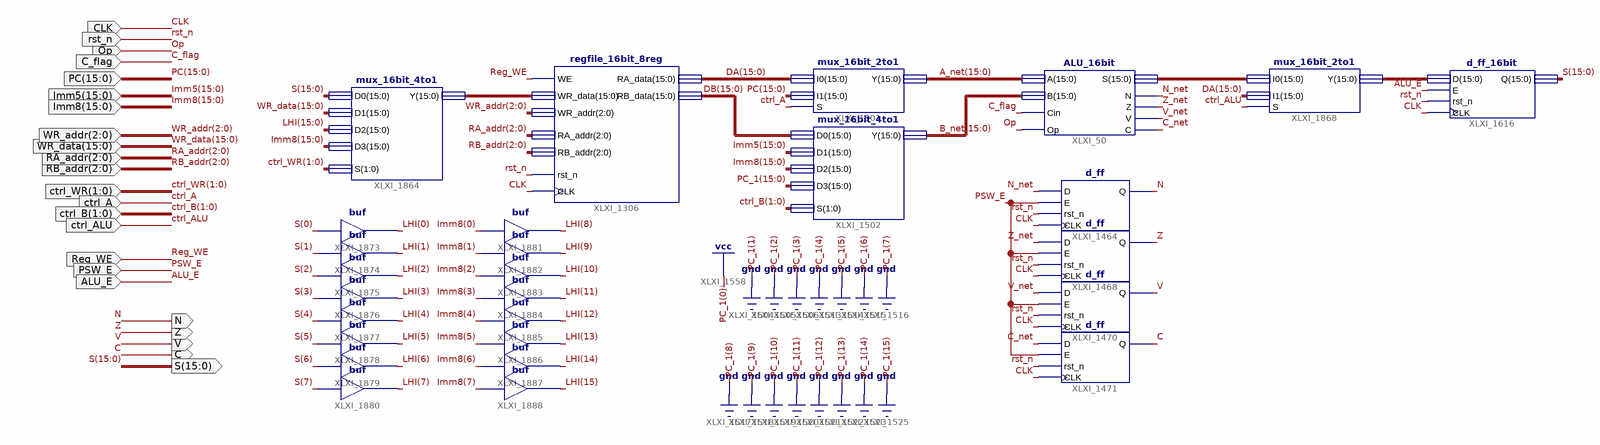
[diagram p0: schematic sheet 1]
// Xilinx ISE schematic RF_ALU_16bit.sch (virtex6) as structural Verilog: 27 symbols, 23 ports
module RF_ALU_16bit (
  input  CLK,
  input  rst_n,
  input  [2:0] RB_addr,
  input  [2:0] RA_addr,
  input  [2:0] WR_addr,
  input  Reg_WE,
  input  C_flag,
  input  Op,
  input  [15:0] WR_data,
  input  [15:0] PC,
  input  ctrl_A,
  input  [15:0] Imm5,
  input  [15:0] Imm8,
  input  [1:0] ctrl_B,
  input  PSW_E,
  input  [1:0] ctrl_WR,
  input  ctrl_ALU,
  input  ALU_E,
  output [15:0] S,
  output N,
  output Z,
  output V,
  output C
);

  wire C_net, N_net, V_net, Z_net;
  wire [15:0] A_net, B_net, DA, DB, LHI, s_net5, XLXN_6667, XLXN_6864;

  regfile_16bit_8reg XLXI_1306 (
    .WE(Reg_WE), .WR_data(s_net5), .WR_addr(WR_addr), .RB_addr(RB_addr), .RA_addr(RA_addr), .RA_data(DA),
    .RB_data(DB), .CLK(CLK), .rst_n(rst_n));
  ALU_16bit XLXI_50 (
    .A(A_net), .B(B_net), .Op(Op), .Z(Z_net), .N(N_net), .S(XLXN_6667), .C(C_net), .V(V_net), .Cin(C_flag));
  mux_16bit_2to1 XLXI_1501 (.S(ctrl_A), .I1(PC), .I0(DA), .Y(A_net));
  mux_16bit_4to1 XLXI_1502 (.S(ctrl_B), .D3(16'b0000000000000001), .D2(Imm8), .D1(Imm5), .D0(DB), .Y(B_net));
  d_ff XLXI_1464 (.E(PSW_E), .D(N_net), .Q(N), .CLK(CLK), .rst_n(rst_n));
  d_ff XLXI_1468 (.E(PSW_E), .D(Z_net), .Q(Z), .CLK(CLK), .rst_n(rst_n));
  d_ff XLXI_1470 (.E(PSW_E), .D(V_net), .Q(V), .CLK(CLK), .rst_n(rst_n));
  d_ff XLXI_1471 (.E(PSW_E), .D(C_net), .Q(C), .CLK(CLK), .rst_n(rst_n));
  mux_16bit_4to1 XLXI_1864 (.S(ctrl_WR), .D3(Imm8), .D2(LHI), .D1(WR_data), .D0(S), .Y(s_net5));
  buf XLXI_1873 (LHI[0], S[0]);
  buf XLXI_1874 (LHI[1], S[1]);
  buf XLXI_1875 (LHI[2], S[2]);
  buf XLXI_1876 (LHI[3], S[3]);
  buf XLXI_1877 (LHI[4], S[4]);
  buf XLXI_1878 (LHI[5], S[5]);
  buf XLXI_1879 (LHI[6], S[6]);
  buf XLXI_1880 (LHI[7], S[7]);
  buf XLXI_1881 (LHI[8], Imm8[0]);
  buf XLXI_1882 (LHI[9], Imm8[1]);
  buf XLXI_1883 (LHI[10], Imm8[2]);
  buf XLXI_1884 (LHI[11], Imm8[3]);
  buf XLXI_1885 (LHI[12], Imm8[4]);
  buf XLXI_1886 (LHI[13], Imm8[5]);
  buf XLXI_1887 (LHI[14], Imm8[6]);
  buf XLXI_1888 (LHI[15], Imm8[7]);
  mux_16bit_2to1 XLXI_1868 (.S(ctrl_ALU), .I1(DA), .I0(XLXN_6667), .Y(XLXN_6864));
  d_ff_16bit XLXI_1616 (.E(ALU_E), .D(XLXN_6864), .Q(S), .CLK(CLK), .rst_n(rst_n));
endmodule
